# Altium schematic sheet SS.SchDoc
size A4; SheetNumber: 2; SheetTotal: 3
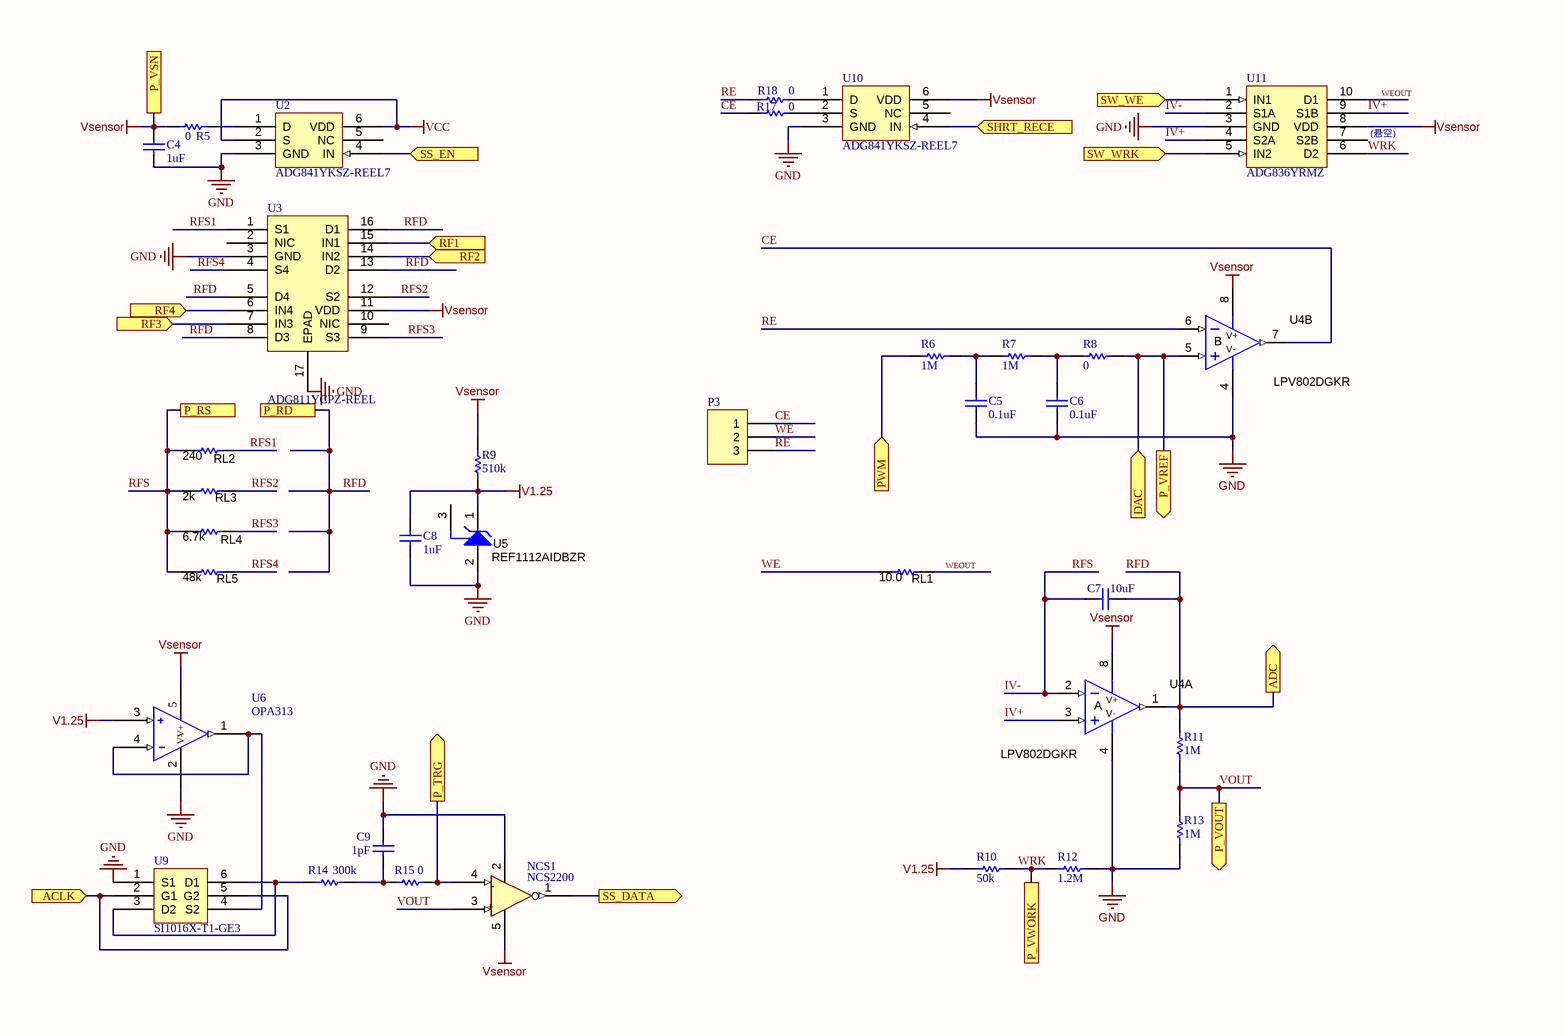
[diagram p0: SS.SchDoc]

## Parts
C4  value 1uF  [0402]
C5  value 0.1uF  [0402]
C6  value 0.1uF  [0402]
C7  value 10uF  [0402]
C8  value 1uF  [0402]
C9  value 1pF  [0805]
NCS1  NCS2200  [SC70-5]
P3  (no value)  [HDR1X3]
R5  value 0  [0402]
R6  value 1M  [0402]
R7  value 1M  [0402]
R8  value 0  [0402]
R9  value 510k  [0402]
R10  value 50k  [0402]
R11  value 1M  [0402]
R12  value 1.2M  [0402]
R13  value 1M  [0402]
R14  value 300k  [0805]
R15  value 0  [0402]
R17  value 0  [0402]
R18  value 0  [0402]
RL1  value 10.0  [0402]  (hidden comment: RT0402BRD0710RL)
RL2  value 240  [0402]  (hidden comment: RT0402BRD07240RL)
RL3  value 2k  [0402]  (hidden comment: RT0402BRD072KL)
RL4  value 6.7k  [0402]  (hidden comment: RT0402BRD076K7L)
RL5  value 48k  [0402]  (hidden comment: RT0402BRD0748KL)
U2  ADG841YKSZ-REEL7  [SOT65P210X110-6N]
U3  ADG811YCPZ-REEL  [QFN50P300X300X90-17N]
U4  LPV802DGKR  [DGK0008A_N]  (parts A,B of 2)
U5  REF1112AIDBZR  [DBZ0003A_N]
U6  OPA313  [SOT95P280X145-5N]
U9  SI1016X-T1-GE3  [SC-89-6 Vishay]
U10  ADG841YKSZ-REEL7  [SOT65P210X110-6N]
U11  ADG836YRMZ  [SOP50P490X110-10N]

## Ports
ACLK (in), ADC (out), DAC (in), P_RD, P_RS, P_TRG (out), P_VOUT (out), P_VREF (out), P_VSN, P_VWORK, PWM (in), RF1 (in), RF2 (in), RF3 (in), RF4 (in), SHRT_RECE (in), SS_DATA (out), SS_EN (in), SW_WE (in), SW_WRK (in)

## Nets
GND: C4.2 C5.2 C6.1 C8.1 C9.1 NCS1.2(GND) R12.2 R13.2 U2.3(GND) U3.3(GND) U3.17(EPAD) U4.4(V-) U5.2(GND) U6.2(V-) U9.1(S1) U10.3(GND) U11.3(GND)
V1.25: C8.2 R9.1 R10.1 U5.1(VO) U6.3
VCC: U2.2(S) U2.6(VDD)
Vsensor: C4.1 NCS1.5(VDD) R5.1 R9.2 U3.11(VDD) U4.8(V+) U6.5(V+) U10.6(VDD) U11.8(VDD) ; port P_VSN
ACLK: U9.2(G1) U9.5(G2) ; port ACLK
CE: P3.1 R17.2 U4.7(OUT)
DAC: R8.2 U4.5(IN+) ; port DAC, port P_VREF
IV+: U4.3(IN+) U11.4(S2A) U11.9(S1B)
IV-: C7.2 RL2.1 RL3.1 RL4.1 RL5.1 U4.2(IN-) U11.2(S1A) ; port P_RS  [also labelled RFS]
P_TRG: NCS1.4(In-) R15.1 ; port P_TRG
PWM: R6.2 ; port PWM
RE: P3.3 R18.2 U4.6(IN-)
RF1: U3.15(IN1) ; port RF1
RF2: U3.14(IN2) ; port RF2
RF3: U3.7(IN3) ; port RF3
RF4: U3.6(IN4) ; port RF4
RFD: C7.1 R11.1 U3.5(D4) U3.8(D3) U3.13(D2) U3.16(D1) U4.1(OUT) ; port ADC, port P_RD
RFS1: RL2.2 U3.1(S1)
RFS2: RL3.2 U3.12(S2)
RFS3: RL4.2 U3.9(S3)
RFS4: RL5.2 U3.4(S4)
SHRT_RECE: U10.4(IN) ; port SHRT_RECE
SS_DATA: NCS1.1(OUT) ; port SS_DATA
SS_EN: U2.4(IN) ; port SS_EN
SW_WE: U11.1(IN1) ; port SW_WE
SW_WRK: U11.5(IN2) ; port SW_WRK
VOUT: NCS1.3(IN+) R11.2 R13.1 ; port P_VOUT
WE: P3.2 RL1.1
WEOUT: RL1.2 U11.10(D1)
WRK: R10.2 R12.1 U11.6(D2) ; port P_VWORK
NetC5_1: C5.1 R6.1 R7.2
NetC6_2: C6.2 R7.1 R8.1
NetC9_2: C9.2 R14.1 R15.2
NetR5_2: R5.2 U2.1(D)
NetR14_2: R14.2 U9.3(D2) U9.6(D1)
NetR17_1: R17.1 U10.2(S)
NetR18_1: R18.1 U10.1(D)
NetU6_1: U6.1 U6.4 U9.4(S2)

Not connected (* = marked no-connect by the designer): U2 5(NC); U3 2(NIC) 10(NIC); U5 3(NC); U10 5(NC); U11 7(S2B)

## Notes on the sheet
- (near U11) (悬空)
- DWG. NO.
- REV.
- SHT.
- THIS DOCUMENT AND THE DATA DISCLOSED HEREIN OR HEREWITH IS THE PROPERTY OF ALTIUM LIMITED AND MAY BE FREELY DISTRIBUTED IN WHOLE. NO RIGHTS ARE RESERVED OR EXPRESS OR IMPLIED WARANTEE GIVEN.
- REVISION
- DESCRIPTION
- DATE
- APPROVED
- ENG:
- APPROVALS
- PROJECT
- DSN:
- CHK:
- REFERENCE DOCUMENTS
- PROJECT REVISION:
- TITLE
- DOCUMENT REVISION:
- DESIGN ITEM:
- BOM:
- FAB DWG:
- PCB DWG:
- ASSY DWG:
- SCALE:
- SIZE
- B
- CAGE CODE
- FILE NAME
- DWG NO.
- SHEET
- OF
- REV
- (in symbol LPV802DGKR, part A) A
- (in symbol LPV802DGKR, part B) B
- (in symbol NCS2200) -; +

## Library data of the parts
C4-C9 = Cap: Ceramic Capacitor (Surface Mount); Manufacturer: Generic Ceramic Chip Cap (TBD); Digi-Key Part Number: *; Manufacturer Part Number: *; Note: *; Rating: *
NCS1 = NCS2200: Comparator: On Semi 10uA Comparator; Manufacturer: ON Semiconductor; Manufacturer Part Number: NCS2200SQ2T2G; Digi-Key Part Number: NCS2200SQ2T2GOSTR-ND; Rating: *; Value: *; Note: *
P3 = Header 3: Header, 3-Pin; LatestRevisionDate: 17-Jul-2002; LatestRevisionNote: Re-released for DXP Platform.; Publisher: Altium Limited
R5-R15 R17 R18 = Res: Chip Resistor (Surface Mount); Manufacturer: Generic Chip Res (TBD); Manufacturer Part Number: *; Digi-Key Part Number: *; Rating: *
RL1 = RT0402BRD0710RL: RES, 10.0, 0.1%, 0.1 W, 0402; Value2: 0.1W; Value1: 0.1%; ComponentLink1Description: Datasheet link; ComponentLink1URL: http://www.yageo.com/pdf/PYu-RT_1-to-0.05_RoHS_L_3.pdf
RL2 = RT0402BRD07240RL: RES, 240, 0.1%, 0.1 W, 0402; Value2: 0.1W; Value1: 0.1%; ComponentLink1Description: Datasheet link; ComponentLink1URL: http://www.yageo.com/pdf/PYu-RT_1-to-0.05_RoHS_L_3.pdf
RL3 = RT0402BRD072KL: RES, 2k, 0.1%, 0.1 W, 0402; Value2: 0.1W; Value1: 0.1%; ComponentLink1Description: Datasheet link; ComponentLink1URL: http://www.yageo.com/pdf/PYu-RT_1-to-0.05_RoHS_L_3.pdf
RL4 = RT0402BRD076K7L: RES, 6.7k, 0.1%, 0.1 W, 0402; Value2: 0.1W; Value1: 0.1%; ComponentLink1Description: Datasheet link; ComponentLink1URL: http://www.yageo.com/pdf/PYu-RT_1-to-0.05_RoHS_L_3.pdf
RL5 = RT0402BRD0748KL: RES, 48k, 0.1%, 0.1 W, 0402; Value2: 0.1W; Value1: 0.1%; ComponentLink1Description: Datasheet link; ComponentLink1URL: http://www.yageo.com/pdf/PYu-RT_1-to-0.05_RoHS_L_3.pdf
U2 U10 = ADG841YKSZ-REEL7: 单通道单刀单掷开关
U3 = ADG811YCPZ-REEL: 四通道单刀单掷开关
U4 = LPV802DGKR: 350 nA Rail-to-Rail I/O Nanopower Operational Amplifier Family, DGK0008A; Alternate PartNumber: LPV802DGKT; Manufacturer: Texas Instruments; CompType: IC; U/M: EA; SizeArea_mm2: 15.655; SizeAreaWB_mm2: 35.955; SizeX_mm: 5.05; SizeY_mm: 3.1; SizeZ_mm: 1.1; SymbolVersion: 2013-12-03; PartNumber: LPV802DGKR; PackageReference: DGK0008A; MountType: SMT; ComponentLink1Description: Datasheet Link; ComponentLink1URL: https://sps06.itg.ti.com/sites/KMS/crossdivteams/altium/docs/ComponentDatasheets/LPV80x_Prelim_20150508-1515_PPR.pdf; Publisher: Texas Instruments; LatestRevisionDate: 2016-06-15; Alternate Manufacturer: Texas Instruments; PackageDescription: VSSOP-8
U5 = REF1112AIDBZR: 1 uA Shunt Voltage Reference, 1.25 V, 10 ppm / degC, 5 mA, -40 to 85 degC, 3-pin SOT-23 (DBZ), Green (RoHS & no Sb/Br); Manufacturer: Texas Instruments; Alternate PartNumber: Equivalent; Initial Accuracy @ 25/deg C(%): 0.2; Iout/Iz(Max)(mA): 5; Min Iz for Regulation(uA): 1.2; Rating: Catalog; Temp Coeff(Max)(ppm/ degree C): 50; Temp Coeff(Typ)(ppm/ degree C): 10; VO(V): 1.25; DatasheetVersion: SBOS283C; PackageVersion: 4203227/B; PackageReference: DBZ0003A; PackageDescription: 3-Pin Plastic Small Outline, Body 2.92 x 1.3 mm, Pitch 0.95 mm; Supplier 1: Digi-Key; Supplier Part Number 1: REF1112AIDBZR-ND; Supplier 2: Newark; Supplier Part Number 2: 87H2545; Supplier 3: Mouser; Supplier Part Number 3: 595-REF1112AIDBZR; Eco-Plan: Green (RoHS & no Sb/Br); SubFamily: Shunt Voltage Reference; MountType: SMT; Code_JEDEC: TO-236; ComponentLink1Description: Manufacturer URL; ComponentLink1URL: http://www.ti.com/; ComponentLink2Description: Datasheet; ComponentLink2URL: http://www.ti.com/general/docs/lit/getliterature.tsp?genericPartNumber=REF1112&fileType=pdf; ComponentLink3Description: Package Specification; ComponentLink3URL: http://www.ti.com/litv/pdf/mpds108a; ComponentLink4Description: URL Link1; ComponentLink4URL: Samples URL:http://www.ti.com/product/ref1112; Alternate Manufacturer: Texas Instruments; PartNumber: REF1112AIDBZR
U6 = OPA313: 低功耗运算放大器
U9 = SI1016X-T1-GE3: N/P沟道增强型MOS管
U11 = ADG836YRMZ: 双通道单刀双掷开关